# Altium schematic sheet main.SchDoc: Main
size A4; ENG_APP_DATE: --/--/--; DSN_APP_DATE: --/--/--; CHK_APP_DATE: --/--/--; Organization: ETHZ D-ITET PBL; DocumentNumber: 1; SheetNumber: 1; SheetTotal: 3; FileInfo: main.SchDoc
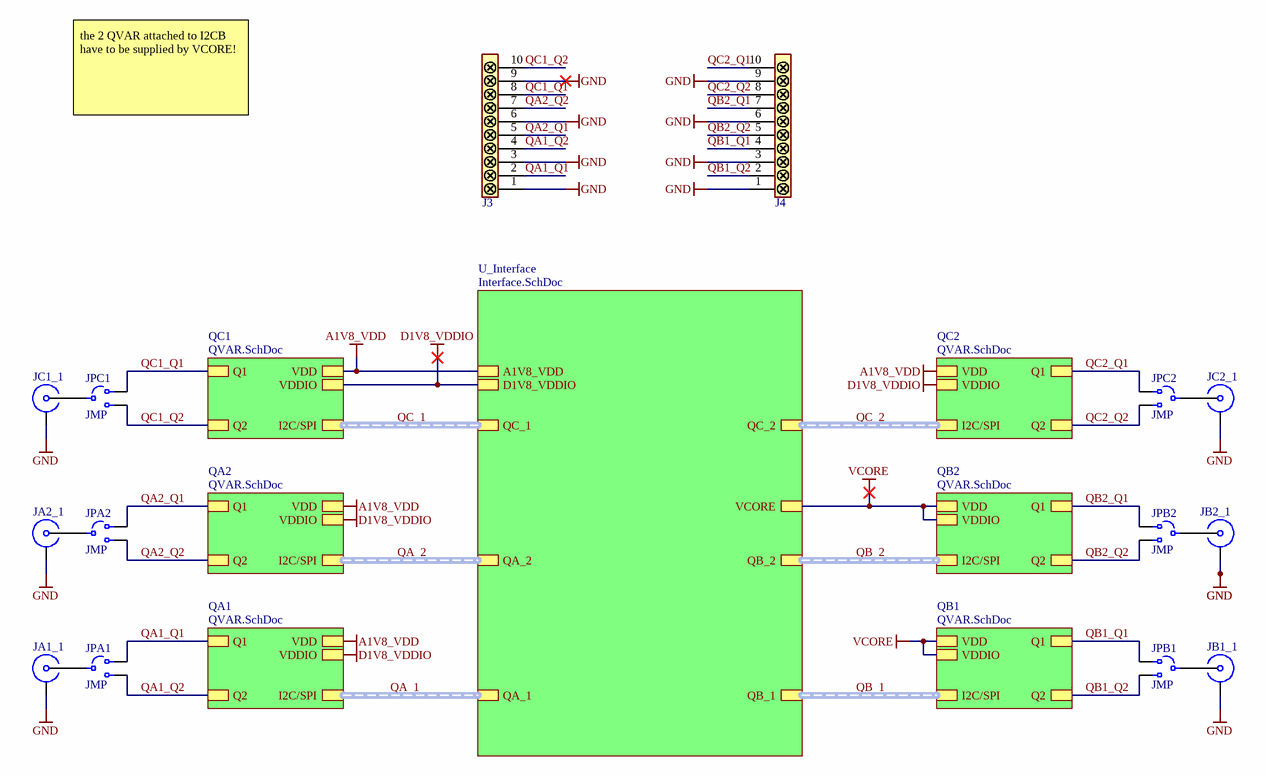
[diagram p0: main.SchDoc]

## Parts
J3  FTS-110-01-L-S  [SAMTEC-FTS-110-01-L-S]  (value not drawn)
J4  FTS-110-01-L-S  [SAMTEC-FTS-110-01-L-S]  (value not drawn)
JA1_1  CONMHF1-SMD-G-T  [C-CONMHF1-SMD-G-T]  (value not drawn)
JA2_1  CONMHF1-SMD-G-T  [C-CONMHF1-SMD-G-T]  (value not drawn)
JB1_1  CONMHF1-SMD-G-T  [C-CONMHF1-SMD-G-T]  (value not drawn)
JB2_1  CONMHF1-SMD-G-T  [C-CONMHF1-SMD-G-T]  (value not drawn)
JC1_1  CONMHF1-SMD-G-T  [C-CONMHF1-SMD-G-T]  (value not drawn)
JC2_1  CONMHF1-SMD-G-T  [C-CONMHF1-SMD-G-T]  (value not drawn)
JPA1  JMP  [JMP_0201_3way]
JPA2  JMP  [JMP_0201_3way]
JPB1  JMP  [JMP_0201_3way]
JPB2  JMP  [JMP_0201_3way]
JPC1  JMP  [JMP_0201_3way]
JPC2  JMP  [JMP_0201_3way]

## Sub-sheets
QA1 = QVAR.SchDoc: Q1, Q2, VDD, VDDIO, I2C/SPI (harness I2C/SPI)
QA2 = QVAR.SchDoc: Q1, Q2, VDD, VDDIO, I2C/SPI (harness I2C/SPI)
QB1 = QVAR.SchDoc: Q1, Q2, VDD, VDDIO, I2C/SPI (harness I2C/SPI)
QB2 = QVAR.SchDoc: Q1, Q2, VDD, VDDIO, I2C/SPI (harness I2C/SPI)
QC1 = QVAR.SchDoc: Q1, Q2, VDD, VDDIO, I2C/SPI (harness I2C/SPI)
QC2 = QVAR.SchDoc: Q1, Q2, VDD, VDDIO, I2C/SPI (harness I2C/SPI)
U_Interface = Interface.SchDoc: QA_1 (harness I2C/SPI), QA_2 (harness I2C/SPI), QB_1 (harness I2C/SPI), QB_2 (harness I2C/SPI), QC_1 (harness I2C/SPI), QC_2 (harness I2C/SPI), D1V8_VDDIO, A1V8_VDD, VCORE

## Nets
A1V8_VDD: sheet QA1/VDD, sheet U_Interface/A1V8_VDD, sheet QA2/VDD, sheet QC1/VDD, sheet QC2/VDD
D1V8_VDDIO: sheet QA1/VDDIO, sheet U_Interface/D1V8_VDDIO, sheet QA2/VDDIO, sheet QC1/VDDIO, sheet QC2/VDDIO
GND: J3.1 J3.3 J3.6 J3.9 J4.1 J4.3 J4.6 J4.9 JA1_1.G JA2_1.G JB1_1.G JB2_1.G JC1_1.G JC2_1.G
VCORE: sheet U_Interface/VCORE, sheet QB1/VDD, sheet QB1/VDDIO, sheet QB2/VDD, sheet QB2/VDDIO
QA1_Q1: J3.2 JPA1.1 ; sheet QA1/Q1
QA1_Q2: J3.4 JPA1.3 ; sheet QA1/Q2
QA2_Q1: J3.5 JPA2.1 ; sheet QA2/Q1
QA2_Q2: J3.7 JPA2.3 ; sheet QA2/Q2
QB1_Q1: J4.4 JPB1.1 ; sheet QB1/Q1
QB1_Q2: J4.2 JPB1.3 ; sheet QB1/Q2
QB2_Q1: J4.7 JPB2.1 ; sheet QB2/Q1
QB2_Q2: J4.5 JPB2.3 ; sheet QB2/Q2
QC1_Q1: J3.8 JPC1.1 ; sheet QC1/Q1
QC1_Q2: J3.10 JPC1.3 ; sheet QC1/Q2
QC2_Q1: J4.10 JPC2.1 ; sheet QC2/Q1
QC2_Q2: J4.8 JPC2.3 ; sheet QC2/Q2
NetJA1_1_S: JA1_1.S JPA1.2
NetJA2_1_S: JA2_1.S JPA2.2
NetJB1_1_S: JB1_1.S JPB1.2
NetJB2_1_S: JB2_1.S JPB2.2
NetJC1_1_S: JC1_1.S JPC1.2
NetJC2_1_S: JC2_1.S JPC2.2

## Buses and harness runs
harness QA_1 = sheet QA1/I2C/SPI = sheet U_Interface/QA_1
harness QA_2 = sheet QA2/I2C/SPI = sheet U_Interface/QA_2
harness QB_1 = sheet QB1/I2C/SPI = sheet U_Interface/QB_1
harness QB_2 = sheet QB2/I2C/SPI = sheet U_Interface/QB_2
harness QC_1 = sheet QC1/I2C/SPI = sheet U_Interface/QC_1
harness QC_2 = sheet QC2/I2C/SPI = sheet U_Interface/QC_2

## Notes on the sheet
- the 2 QVAR attached to I2CB have to be supplied by VCORE!
- Project:
- Laboratory:
- Date:
- File:
- Rev:
- Variation:
- Drawn By:
- Checked By:
- Sheet:
- /

## Library data of the parts
J3 J4 = FTS-110-01-L-S: Pinheader 10 pin, 1.27mm; Manufacturer: Samtec; Manufacturer Series: FTS; Connector Type: BOARD CONNECTOR; Option: General Purpose; Mixed Contacts: No; Number of Rows Loaded: 1; Number of Contacts: 10; Additional Feature: Low Profile; Supplier 1: Mouser; Manufacturer Part Number: FTS-110-01-L-S; RoHS: Yes; Category: Connectors; Stock 1: 83; Pricing 1: 1=2.85, 10=2.62, 50=2.62, 100=2.28, 1000=1.66, 10000=1.48 (USD); Mounting Technology: Board; Contact Material: Bronze; Contact Finish - Mating: GOLD (10) OVER NICKEL (50); Contact Finish - Termination: Matte Tin (Sn) - with Nickel (Ni) barrier; JESD-609 Code: e3; Contact Gender: Male; Mounting Style: STRAIGHT; Termination: Solder; Terminal Pitch: 1.27mm; Flammability Rating: UL94 V-0; IEC Conformance: No; MIL Conformance: No; Reach SVHC Compliant: Yes; RoHS Compliant: Yes; ComponentLink1URL: https://datasheet.ciiva.com:443/pdfs/VipMasterIC/IC/SAMI/SAMI-S-A0001504673/SAMI-S-A0001504673-1.pdf?src-supplier=IHS+Markit; ComponentLink1Description: https://datasheet.ciiva.com:443/pdfs/VipMasterIC/IC/SAMI/SAMI-S-A0001504673/SAMI-S-A0001504673-1.pdf?src-supplier=IHS+Markit; Supplier Part Number 1: 200-FTS11001LS; ComponentLink2Description: http://www.samtec.com/documents/webfiles/pdf/FTS.pdf?src-supplier=Avnet; ComponentLink2URL: http://www.samtec.com/documents/webfiles/pdf/FTS.pdf?src-supplier=Avnet; ComponentLink3Description: https://datasheet.octopart.com/FTS-110-01-L-S-Samtec-datasheet-151470456.pdf?src-supplier=Sager+Electronics; ComponentLink3URL: https://datasheet.octopart.com/FTS-110-01-L-S-Samtec-datasheet-151470456.pdf?src-supplier=Sager+Electronics; ComponentLink4Description: https://datasheet.octopart.com/FTS-110-01-L-S-Samtec-datasheet-118493358.pdf?src-supplier=Electro+Sonic; ComponentLink4URL: https://datasheet.octopart.com/FTS-110-01-L-S-Samtec-datasheet-118493358.pdf?src-supplier=Electro+Sonic; ComponentLink5Description: https://datasheet.octopart.com/FTS-110-01-L-S-Samtec-datasheet-116535195.pdf?src-supplier=Toby+Electronics; ComponentLink5URL: https://datasheet.octopart.com/FTS-110-01-L-S-Samtec-datasheet-116535195.pdf?src-supplier=Toby+Electronics; DIN Conformance: No; Filter Feature: No
JA1_1 JA2_1 JB1_1 JB2_1 JC1_1 JC2_1 = CONMHF1-SMD-G-T: Conn Umc Jack Str SMD; Manufacturer: TE Connectivity; Supplier 1: Mouser; Manufacturer Part Number: CONMHF1-SMD-G-T; RoHS: No; Supplier Part Number 1: 712-CONMHF1-SMD-G-T
JPA1 JPA2 JPB1 JPB2 JPC1 JPC2 = JMP_0201_3w: JMP 0201 3W; Manufacturer: Panasonic; Manufacturer Part Number: ERJ-1GN0R00C; Package Height: 0.23mm; Package Length: 0.6mm; Package Width: 0.3mm; Power: 50mW; Rated Temperature: 70°C; Reference Standard: AEC-Q200; Value: 0R; Case/Package: 0201; Category: Chip SMD Resistors; ComponentLink1Description: https://datasheet.ciiva.com:443/pdfs/VipMasterIC/IC/PANA/PANA-S-A0009459603/PANA-S-A0009459603-1.pdf?src-supplier=IHS+Markit; ComponentLink1URL: https://datasheet.ciiva.com:443/pdfs/VipMasterIC/IC/PANA/PANA-S-A0009459603/PANA-S-A0009459603-1.pdf?src-supplier=IHS+Markit; ComponentLink2Description: https://datasheet.ciiva.com/22730/1678796-22730749.pdf?src-supplier=Element14; ComponentLink2URL: https://datasheet.ciiva.com/22730/1678796-22730749.pdf?src-supplier=Element14; Construction: Rectangular; JESD-609 Code: e3; Max Operating Temperature: 125°C; Min Operating Temperature: -55°C; Mounting Technology: Surface Mount; Package Shape: Rectangular; Package Style: SMTMeter; Packaging: Tape and Reel; Pins: 2; Pricing 1: 1=0.1, 10=0.016, 50=0.016, 100=0.007, 1000=0.007, 10000=0.005 (USD); Reach SVHC Compliant: Yes; Resistor Type: FIXED RESISTOR; RoHS: Yes; RoHS Compliant: Yes; Stock 1: 2803988; Supplier 1: Mouser; Supplier Part Number 1: 667-ERJ-1GN0R00C; Technology: METAL GLAZE/THICK FILM; Terminal Finish: Nickel; Termination: Wraparound